# Altium schematic sheet RS232_Level_Shifters.SchDoc
size A4; SheetNumber: 7; SheetTotal: 7
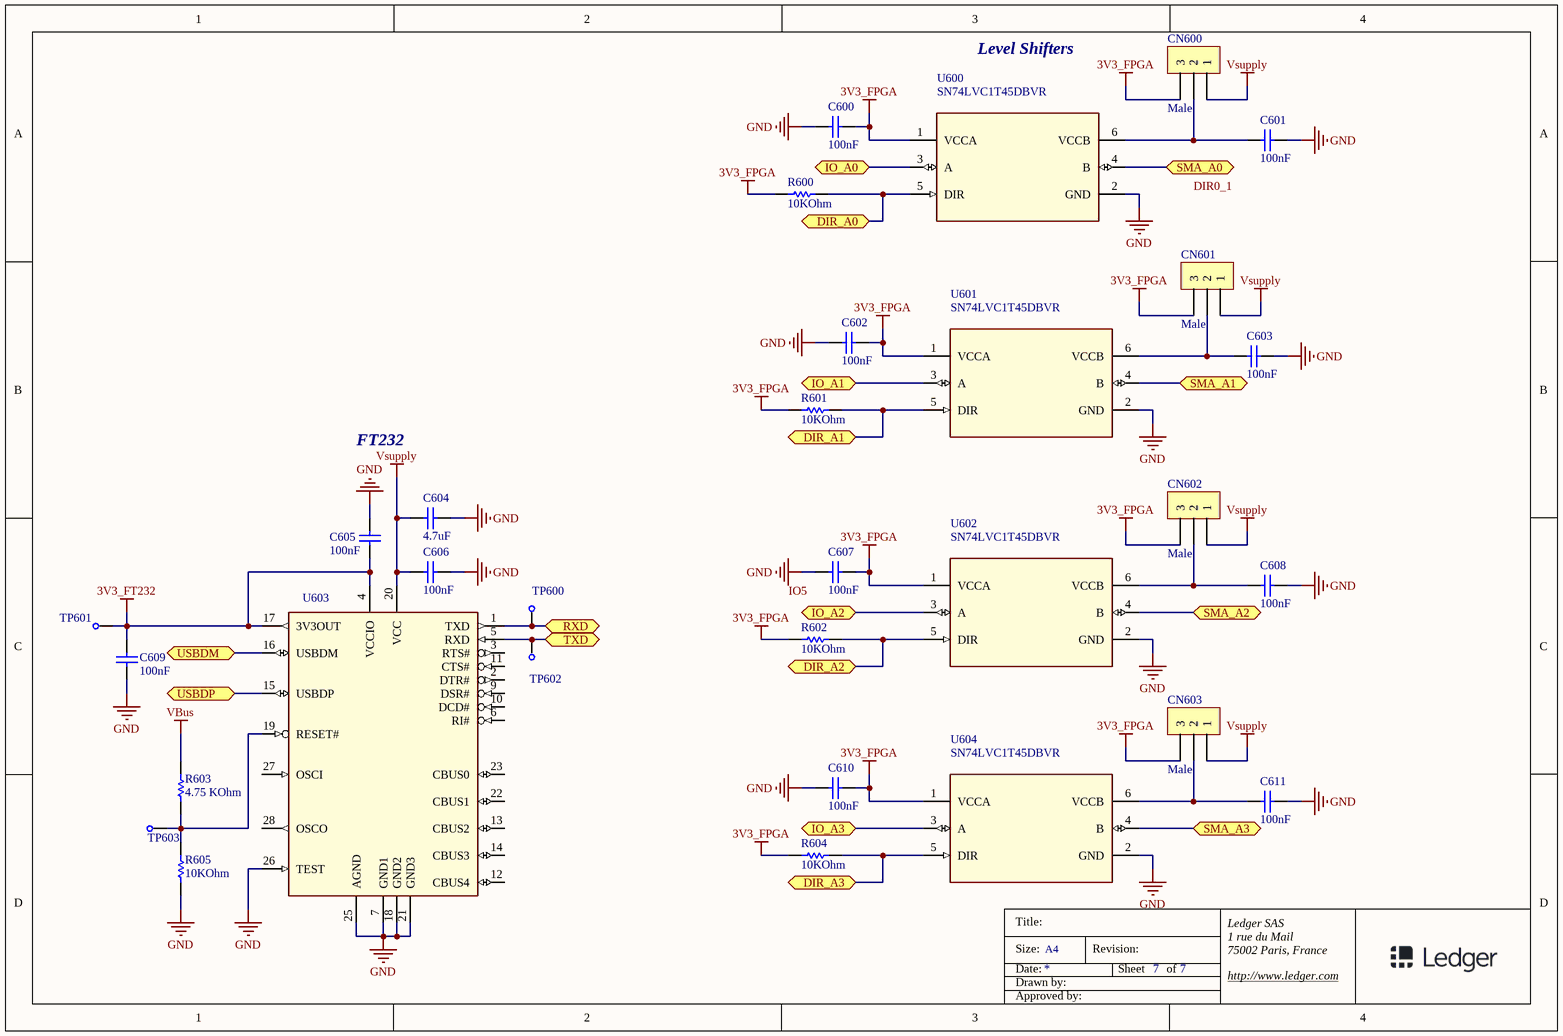
[diagram p0: RS232_Level_Shifters.SchDoc]

## Parts
C600  100nF  [CAP0603]
C601  100nF  [CAP0603]
C602  100nF  [CAP0603]
C603  100nF  [CAP0603]
C604  4.7uF  [CAP0603]
C605  100nF  [CAP0603]
C606  100nF  [CAP0603]
C607  100nF  [CAP0603]
C608  100nF  [CAP0603]
C609  100nF  [CAP0603]
C610  100nF  [CAP0603]
C611  100nF  [CAP0603]
CN600  Male  [MOLEX_90120-0123]
CN601  Male  [MOLEX_90120-0123]
CN602  Male  [MOLEX_90120-0123]
CN603  Male  [MOLEX_90120-0123]
R600  10KOhm  [RES0603]
R601  10KOhm  [RES0603]
R602  10KOhm  [RES0603]
R603  4.75 KOhm  [RES0603]
R604  10KOhm  [RES0603]
R605  10KOhm  [RES0603]
TP600  (no value)  [TP_001]  (no BOM)
TP601  (no value)  [TP_001]  (no BOM)
TP602  (no value)  [TP_001]  (no BOM)
TP603  (no value)  [TP_001]  (no BOM)
U600  SN74LVC1T45DBVR  [SOT95P280X145-6N]
U601  SN74LVC1T45DBVR  [SOT95P280X145-6N]
U602  SN74LVC1T45DBVR  [SOT95P280X145-6N]
U603  IC - USB-to-UART 1-CH 256Byte FIFO - 5V - 28-Pin SSOP  [SSOP28DB]  (value not drawn)
U604  SN74LVC1T45DBVR  [SOT95P280X145-6N]

## Ports
DIR_A0, DIR_A1, DIR_A2, DIR_A3, IO_A0, IO_A1, IO_A2, IO_A3, RXD, SMA_A0, SMA_A1, SMA_A2, SMA_A3, TXD, USBDM, USBDP

## Nets
3V3_FPGA: C600.2 C602.2 C607.2 C610.2 CN600.3 CN601.3 CN602.3 CN603.3 R600.2 R601.2 R602.2 R604.2 U600.1(VCCA) U601.1(VCCA) U602.1(VCCA) U604.1(VCCA)
3V3_FT232: C605.1 C609.1 TP601.1 U603.4(VCCIO) U603.17(3V3OUT)
GND: C600.1 C601.1 C602.1 C603.1 C604.2 C605.2 C606.2 C607.1 C608.1 C609.2 C610.1 C611.1 R605.1 U600.2(GND) U601.2(GND) U602.2(GND) U603.7(GND1) U603.18(GND2) U603.21(GND3) U603.25(AGND) U603.26(TEST) U604.2(GND)
VBus: R603.2
Vsupply: C604.1 C606.1 CN600.1 CN601.1 CN602.1 CN603.1 U603.20(VCC)
DIR_A0: R600.1 U600.5(DIR) ; port DIR_A0
DIR_A1: R601.1 U601.5(DIR) ; port DIR_A1
DIR_A2: R602.1 U602.5(DIR) ; port DIR_A2
DIR_A3: R604.1 U604.5(DIR) ; port DIR_A3
IO_A0: U600.3(A) ; port IO_A0
IO_A1: U601.3(A) ; port IO_A1
IO_A2: U602.3(A) ; port IO_A2
IO_A3: U604.3(A) ; port IO_A3
RXD: TP600.1 U603.1(TXD) ; port RXD
SMA_A0: U600.4(B) ; port SMA_A0
SMA_A1: U601.4(B) ; port SMA_A1
SMA_A2: U602.4(B) ; port SMA_A2
SMA_A3: U604.4(B) ; port SMA_A3
TXD: TP602.1 U603.5(RXD) ; port TXD
USBDM: U603.16(USBDM) ; port USBDM
USBDP: U603.15(USBDP) ; port USBDP
NetC601_2: C601.2 CN600.2 U600.6(VCCB)
NetC603_2: C603.2 CN601.2 U601.6(VCCB)
NetC608_2: C608.2 CN602.2 U602.6(VCCB)
NetC611_2: C611.2 CN603.2 U604.6(VCCB)
NetR603_1: R603.1 R605.2 TP603.1 U603.19(RESET#)

Not connected (* = marked no-connect by the designer): U603 2(DTR#) 3(RTS#) 6(RI#) 9(DSR#) 10(DCD#) 11(CTS#) 12(CBUS4) 13(CBUS2) 14(CBUS3) 22(CBUS1) 23(CBUS0) 27(OSCI) 28(OSCO)

## Notes on the sheet
- Level Shifters
- FT232
- Labels drawn without touching a wire or pin: DIR0_1, IO5
- Title:
- Size:
- Date:
- Drawn by:
- A4
- Revision:
- Sheet
- of
- Ledger SAS
- 1 rue du Mail
- 75002 Paris, France
- http://www.ledger.com
- Approved by:

## Library data of the parts
C600-C603 C605 C607-C611 = Capacitor 0603 - 100nF - 16V - X7R - 10%: Manufacturer2 PN: MCCA000159; Manufacturer1: Yageo; Manufacturer1 PN: CC0603KRX7R7BB104; Manufacturer: Wurth; Manufacturer PN: 885012206046; PkgCode: 0603; Manufacturer2: Multicomp; Value: 100nF; Power: 16V; Tolerance: 10%; Type: X7R
C604 = Capacitor 0603 -  4.7uF - 16V - X5R - 10%: Capacitor 0603 - 4.7uF - 16V - X5R - 10%; Manufacturer: Murata; Manufacturer PN: GRM188R61C475KE11; Manufacturer1: TDK; Manufacturer1 PN: C1608X5R1C475K080AC; PkgCode: 0603; value: 4.7uF; Type: X5R; Tolerance: 10%; Power: 16V
C606 = Capacitor 0603 - 100nF - 16V - X7R - 10%: Manufacturer: Wurth; Manufacturer PN: 885012206046; Manufacturer2 PN: MCCA000159; Manufacturer1: Yageo; Manufacturer1 PN: CC0603KRX7R7BB104; PkgCode: 0603; Value: 100nF; Power: 16V; Tolerance: 10%; Type: X7R; Manufacturer2: Multicomp
CN600-CN603 = Connector - Header - 3-Pin - single row - Male - Molex_90120-0123: Manufacturer: Molex; NoPins: 3; NoRows: 1; Pitch: 2.54; Manufacturer PN: 90120-0123; Type: Male
R600-R602 R604 R605 = Resistor 0603 -    10KOhm - 1/10W - 1%: Manufacturer: Yageo; Manufacturer PN: RC0603FR-0710KL; Manufacturer1: Panasonic; Manufacturer1 PN: ERJ3EKF1002; Manufacturer2 PN: RK73H1JHT..1002F; PkgCode: 0603; Value: 10KOhm; Tolerance: 1%; Power: 1/10W; Manufacturer2: KOA Speer
R603 = Resistor 0603 - 4.75KOhm - 1/10W - 1%: Manufacturer PN: CRCW06034K75FKEA; Manufacturer: Vishay; PkgCode: 0603; Value: 4.75 KOhm; Power: 1/10W; Tolerance: 1%
TP600-TP603 = Misc - Test point CMS
U600-U602 U604 = Logic - Level Shifter - 1.65V - 5.5V - 420Mbps -3-state - SOT23-6 - Texas Instruments - SN74LVC1T45DBVR: Manufacturer PN: SN74LVC1T45DBVR; Manufacturer: Texas Instruments; Application_BuildNumber: *
U603 = IC - USB-to-UART 1-CH 256Byte FIFO - 5V - 28-Pin SSOP: Manufacturer: FTDI; Manufacturer PN: FT232RL